# EAGLE schematic Blip V1_5 (EAGLE 9.2.2)
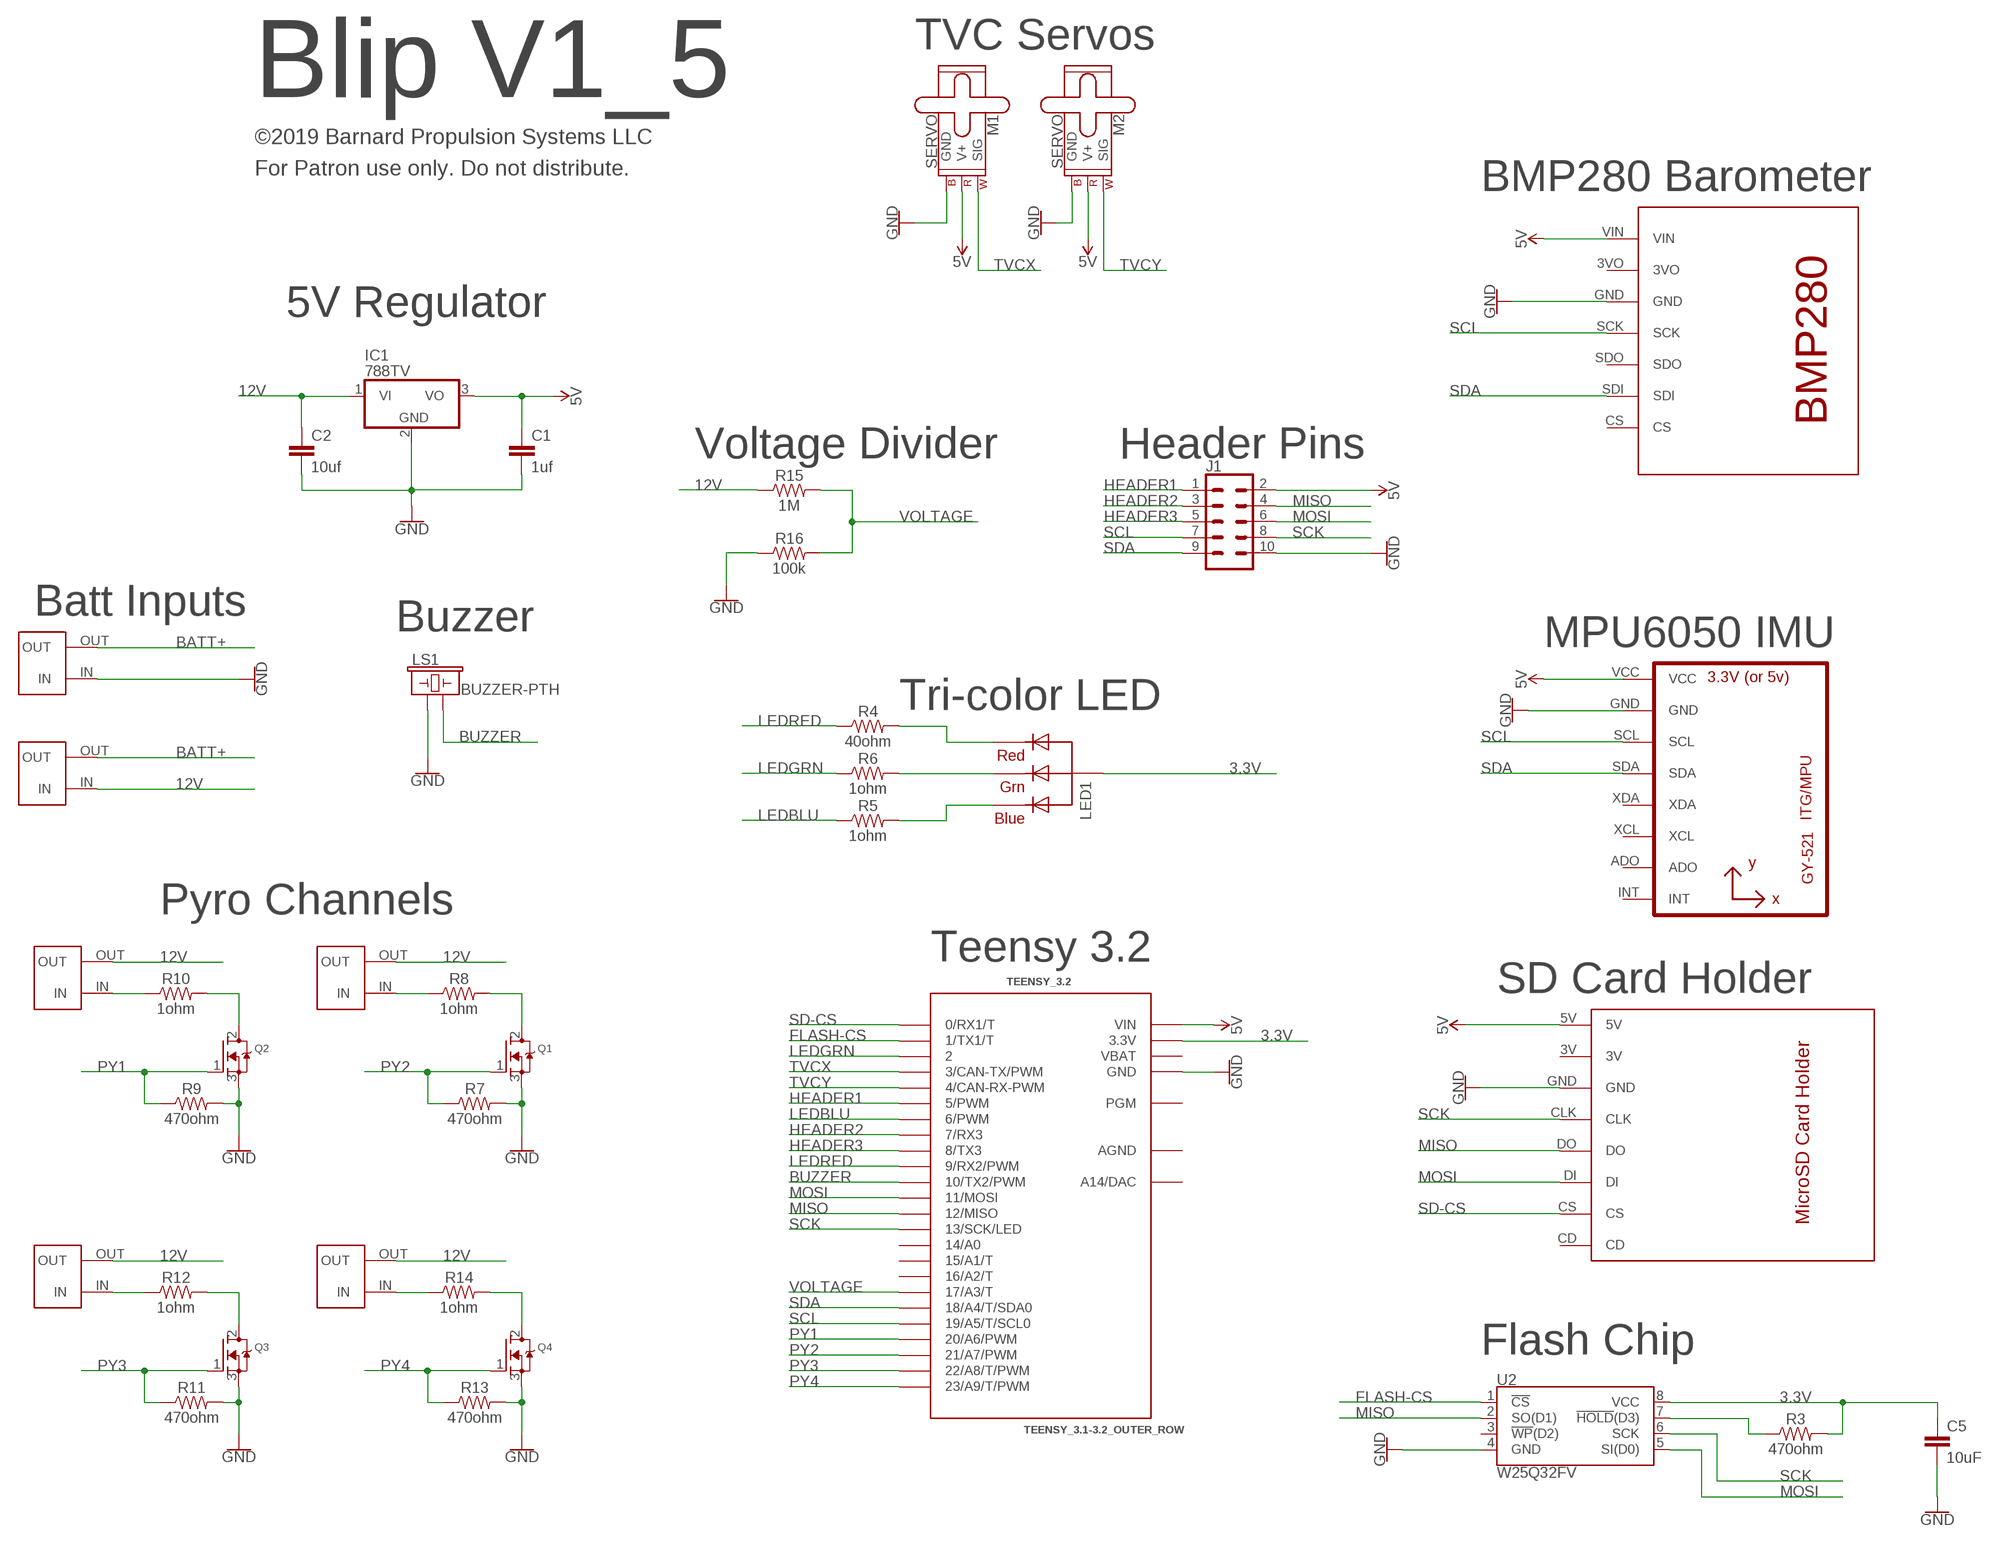
[diagram p0: schematic, sheet 1]

## Parts
C1  1uf  22PF-PTH-2.54MM-200V-5%  [CAP-PTH-2.54]
C2  10uf  22PF-PTH-2.54MM-200V-5%  [CAP-PTH-2.54]
C5  10uF  22PF-PTH-2.54MM-200V-5%  [CAP-PTH-2.54]
IC1  788TV  [TO220V]
J1  CONN_05X2NO_SILK  [2X5_NOSILK]
LED1  RGBLED_CA-5MM  [LED5MMRGB]
LS1  BUZZER-PTH  [BUZZER-12MM]
M1  SERVO  [1X03]
M2  SERVO  [1X03]
Q1  MOSFET-NGDS_TO220V  [TO220V]
Q2  MOSFET-NGDS_TO220V  [TO220V]
Q3  MOSFET-NGDS_TO220V  [TO220V]
Q4  MOSFET-NGDS_TO220V  [TO220V]
R3  470ohm  10MOHM-HORIZ-1/4W-5%  [AXIAL-0.3]
R4  40ohm  10MOHM-HORIZ-1/4W-5%  [AXIAL-0.3]
R5  1ohm  10MOHM-HORIZ-1/4W-5%  [AXIAL-0.3]
R6  1ohm  10MOHM-HORIZ-1/4W-5%  [AXIAL-0.3]
R7  470ohm  10MOHM-HORIZ-1/4W-5%  [AXIAL-0.3]
R8  1ohm  10MOHM-HORIZ-1/4W-5%  [AXIAL-0.3]
R9  470ohm  10MOHM-HORIZ-1/4W-5%  [AXIAL-0.3]
R10  1ohm  10MOHM-HORIZ-1/4W-5%  [AXIAL-0.3]
R11  470ohm  10MOHM-HORIZ-1/4W-5%  [AXIAL-0.3]
R12  1ohm  10MOHM-HORIZ-1/4W-5%  [AXIAL-0.3]
R13  470ohm  10MOHM-HORIZ-1/4W-5%  [AXIAL-0.3]
R14  1ohm  10MOHM-HORIZ-1/4W-5%  [AXIAL-0.3]
R15  1M  10MOHM-HORIZ-1/4W-5%  [AXIAL-0.3]
R16  100k  10MOHM-HORIZ-1/4W-5%  [AXIAL-0.3]
TEENSY_3.2  TEENSY_3.1-3.2_OUTER_ROW  [TEENSY_3.0-3.2&LC_OUTER_ROW]
U1  GY-521MPU6050  [GY-521]
U2  W25Q32FV  W25Q32FVSS  [SOIC-8]
U$2  BMP280  [BMP280]
U$3  MICROSDCARDHOLDER  [SDCARDHOLDER]
U$4  BLACKTERMBLOCK  [BLACKTERMBLOCK]
U$5  BLACKTERMBLOCK  [BLACKTERMBLOCK]
U$6  BLACKTERMBLOCK  [BLACKTERMBLOCK]
U$7  BLACKTERMBLOCK  [BLACKTERMBLOCK]
U$8  BLACKTERMBLOCK  [BLACKTERMBLOCK]
U$9  BLACKTERMBLOCK  [BLACKTERMBLOCK]

## Nets
3.3V: C5.1 LED1.2(VCC) R3.P$2 TEENSY_3.2.3.3V TEENSY_3.2.3.3V1(3.3V) U2.8(VCC)
5V: C1.1 IC1.3(VO) J1.2 M1.2(V+) M2.2(V+) TEENSY_3.2.VIN U1.VCC U$2.VIN U$3.5V
12V: C2.1 IC1.1(VI) R15.P$1 U$4.OUT U$5.OUT U$6.OUT U$7.OUT U$9.IN
BATT+: U$8.OUT U$9.OUT
BUZZER: LS1.- TEENSY_3.2.10(10/TX2/PWM)
FLASH-CS: TEENSY_3.2.1(1/TX1/T) U2.1(!CS!)
GND: C1.2 C2.2 C5.2 IC1.2(GND) J1.10 LS1.+ M1.3(GND) M2.3(GND) Q1.3(S) Q2.3(S) Q3.3(S) Q4.3(S) R7.P$2 R9.P$2 R11.P$2 R13.P$2 R16.P$1 TEENSY_3.2.GND TEENSY_3.2.GND1(GND) U1.GND U2.4(GND) U$2.GND U$3.GND U$8.IN
HEADER1: J1.1 TEENSY_3.2.5(5/PWM)
HEADER2: J1.3 TEENSY_3.2.7(7/RX3)
HEADER3: J1.5 TEENSY_3.2.8(8/TX3)
LEDBLU: R5.P$1 TEENSY_3.2.6(6/PWM)
LEDGRN: R6.P$1 TEENSY_3.2.2
LEDRED: R4.P$1 TEENSY_3.2.9(9/RX2/PWM)
MISO: J1.4 TEENSY_3.2.12(12/MISO) U2.2(SO(D1)) U$3.DO
MOSI: J1.6 TEENSY_3.2.11(11/MOSI) U2.5(SI(D0)) U$3.DI
N$1: LED1.1(RED) R4.P$2
N$2: R3.P$1 U2.7(!HOLD!(D3))
N$3: LED1.3(GREEN) R6.P$2
N$4: LED1.4(BLUE) R5.P$2
N$5: R8.P$1 U$4.IN
N$6: Q1.2(D) R8.P$2
N$8: R10.P$1 U$5.IN
N$9: Q2.2(D) R10.P$2
N$11: R12.P$1 U$6.IN
N$12: Q3.2(D) R12.P$2
N$14: R14.P$1 U$7.IN
N$15: Q4.2(D) R14.P$2
PY1: Q2.1(G) R9.P$1 TEENSY_3.2.20/A6(20/A6/PWM)
PY2: Q1.1(G) R7.P$1 TEENSY_3.2.21/A7(21/A7/PWM)
PY3: Q3.1(G) R11.P$1 TEENSY_3.2.22/A8(22/A8/T/PWM)
PY4: Q4.1(G) R13.P$1 TEENSY_3.2.23/A9(23/A9/T/PWM)
SCK: J1.8 TEENSY_3.2.13(13/SCK/LED) U2.6(SCK) U$3.CLK
SCL: J1.7 TEENSY_3.2.19/A5(19/A5/T/SCL0) U1.SCL U$2.SCK
SD-CS: TEENSY_3.2.0(0/RX1/T) U$3.CS
SDA: J1.9 TEENSY_3.2.18/A4(18/A4/T/SDA0) U1.SDA U$2.SDI
TVCX: M1.1(SIG) TEENSY_3.2.3(3/CAN-TX/PWM)
TVCY: M2.1(SIG) TEENSY_3.2.4(4/CAN-RX-PWM)
VOLTAGE: R15.P$2 R16.P$2 TEENSY_3.2.17/A3(17/A3/T)
Unconnected: TEENSY_3.2.14/A0 TEENSY_3.2.15/A1(15/A1/T) TEENSY_3.2.16/A2(16/A2/T) TEENSY_3.2.PGM TEENSY_3.2.RESET/DAC(A14/DAC) U1.ADO U1.INT U1.XCL U1.XDA U2.3(!WP!(D2)) U$2.3VO U$2.CS U$2.SDO U$3.3V U$3.CD

## Notes on the sheet
- TVC Servos
- Blip V1_5
- ©2019 Barnard Propulsion Systems LLC
- For Patron use only. Do not distribute.
- BMP280 Barometer
- 5V Regulator
- Voltage Divider | Header Pins
- Batt Inputs
- Buzzer
- MPU6050 IMU
- Tri-color LED
- Pyro Channels
- Teensy 3.2
- SD Card Holder
- Flash Chip

## Power pins joined to a net without a drawn wire
AGND: TEENSY_3.2.AGND
VBAT: TEENSY_3.2.VBAT

## Library data of the parts
C1 C2 C5 = SparkFun-Capacitors:22PF: 22pF ceramic capacitors A capacitor is a passive two-terminal electrical component used to store electrical energy temporarily in an electric field.; PROD_ID: CAP-09128; VALUE: 22pF
IC1 = linear:78*: Positive VOLTAGE REGULATOR Source: http://cache.national.com/ds/LM/LM78L05.pdf http://www.fairchildsemi.com/ds/LM/LM7805.pdf
J1 = SparkFun-Connectors:CONN_05X2: Multi connection point. Often used as Generic Header-pin footprint for 0.1 inch spaced/style header connections For AVR SPI programming port, see special device with nice symbol: "AVR_SPI_PROG_5x2.dev" You can populate with any combo of single row headers, but if you'd like an exact match, check these: 2x5 AVR ICSP Male Header <https://www.sparkfun.com/products/778> (PRT-00778) 2x5 Pin Shrouded Header <https://www.sparkfun.com/products/8506> (PRT-08506) On any of the 0.1 inch spaced packages, you can populate with these: Break Away Headers - Straight <https://www.sparkfun.com/products/116> (PRT-00116) Break Away Male Headers - Right Angle <https://www.sparkfun.com/products/553> (PRT-00553) Female Headers <https://www.sparkfun.com/products/115> (PRT-00115) Break Away Headers - Machine Pin <https://www.sparkfun.com/products/117> (PRT-00117) Break Away Female Headers - Swiss Machine Pin <https://www.sparkfun.com/products/743> (PRT-00743) Special note: the shrouded connector mates well with our 5x2 ribbon cables: 2x5 Pin IDC Ribbon Cable <https://www.sparkfun.com/products/8535> (PRT-08535)
LED1 = adafruit:RGBLED_CA: RGB LED, common-anode 5MM Staggered pins 5mm Piranha package http://www.ladyada.net/library/pcb/eaglelibrary.html
LS1 = SparkFun-Electromechanical:BUZZER: Buzzer Small round buzzers that operate around the audible 2kHz range. You can use these as speakers to create simple music or user interfaces. Variant Overview: PTH - Mini Speaker - PC Mount 12mm 2.048kHz <https://www.sparkfun.com/products/7950> PTH_KIT - Mini Speaker - PC Mount 12mm 2.048kHz <https://www.sparkfun.com/products/7950> KIT simplifies soldering by adding stop mask to one side of the pads. PTH_NO_SILK - Mini Speaker - PC Mount 12mm 2.048kHz <https://www.sparkfun.com/products/7950> No silkscreen indicator of buzzer outline. PTH_KIT_NO_SILK - Mini Speaker - PC Mount 12mm 2.048kHz <https://www.sparkfun.com/products/7950> KIT package w/o silkscreen SMD - Buzzer Audio Magnetic (CCV-084B16) SMD buzzer used on, e.g. the LilyPad Buzzer <https://www.sparkfun.com/products/8463> and RFID USB Reader <https://www.sparkfun.com/products/9963>. SMD_KIT - Buzzer Audio Magnetic (CCV-084B16) SMD Buzzer with elongated pins to make soldering easier. Used on the SparkFun Simon Says - Surface Mount Soldering Kit <https://www.sparkfun.com/products/10935>.; PROD_ID: COMP-08253; SF_SKU: COM-07950
M1 M2 = SparkFun-Electromechanical:SERVO: Servo Motor 3-pin connector for a standard servo motor (voltage supply, ground, and control signal.) SparkFun Products Servo - Generic (Sub-Micro Size) <https://www.sparkfun.com/products/9065> (ROB-09065) Servo - Generic High Torque Continuous Rotation (Standard Size) <https://www.sparkfun.com/products/9347> (ROB-09347) Servo - Generic High Torque (Standard Size) <https://www.sparkfun.com/products/11965> (ROB-11965)
Q1-Q4 = adafruit:MOSFET-N: N-Channel Mosfet 2N7002E - 60V 260mA SOT23 [Digikey: 2N7002ET1GOSTR-ND] - REEL BSH103 - 30V 850mA SOT23 [Digikey: 568-5013-1-ND]
R3-R16 = SparkFun-Resistors:10MOHM: RES-09327; PROD_ID: RES-09327; VALUE: 10M
TEENSY_3.2 = Teensy_3_and_LC_Series_Boards_v1.4:TEENSY_3.1-3.2_OUTER_ROW: Footprint for Teensy 3.1 or 3.2 board using all pin connections on the outer perimeter
U1 = gy-521:GY-521
U2 = SparkFun-IC-Memory:W25Q32FV: W25Q32FV 32Mb (4MB) Serial Flash Memory The W25Q32FV support the standard Serial Peripheral Interface (SPI), Dual/Quad I/O SPI as well as 2-clocks instruction cycle Quad Peripheral Interface (QPI). 104MHz, SPI, 8-SOIC-EIAJ Datasheet <http://www.winbond.com/resource-files/w25q32fv%20revh%20091613.pdf> SparkFun Products SparkFun Blynk Board - ESP8266 <https://www.sparkfun.com/products/13794> (WRL-13794); PROD_ID: IC-13229
U$2 = BMP280:BMP280
U$3 = SDCardHolder:MICROSDCARDHOLDER
U$4-U$9 = BlackTermBlock:BLACKTERMBLOCK